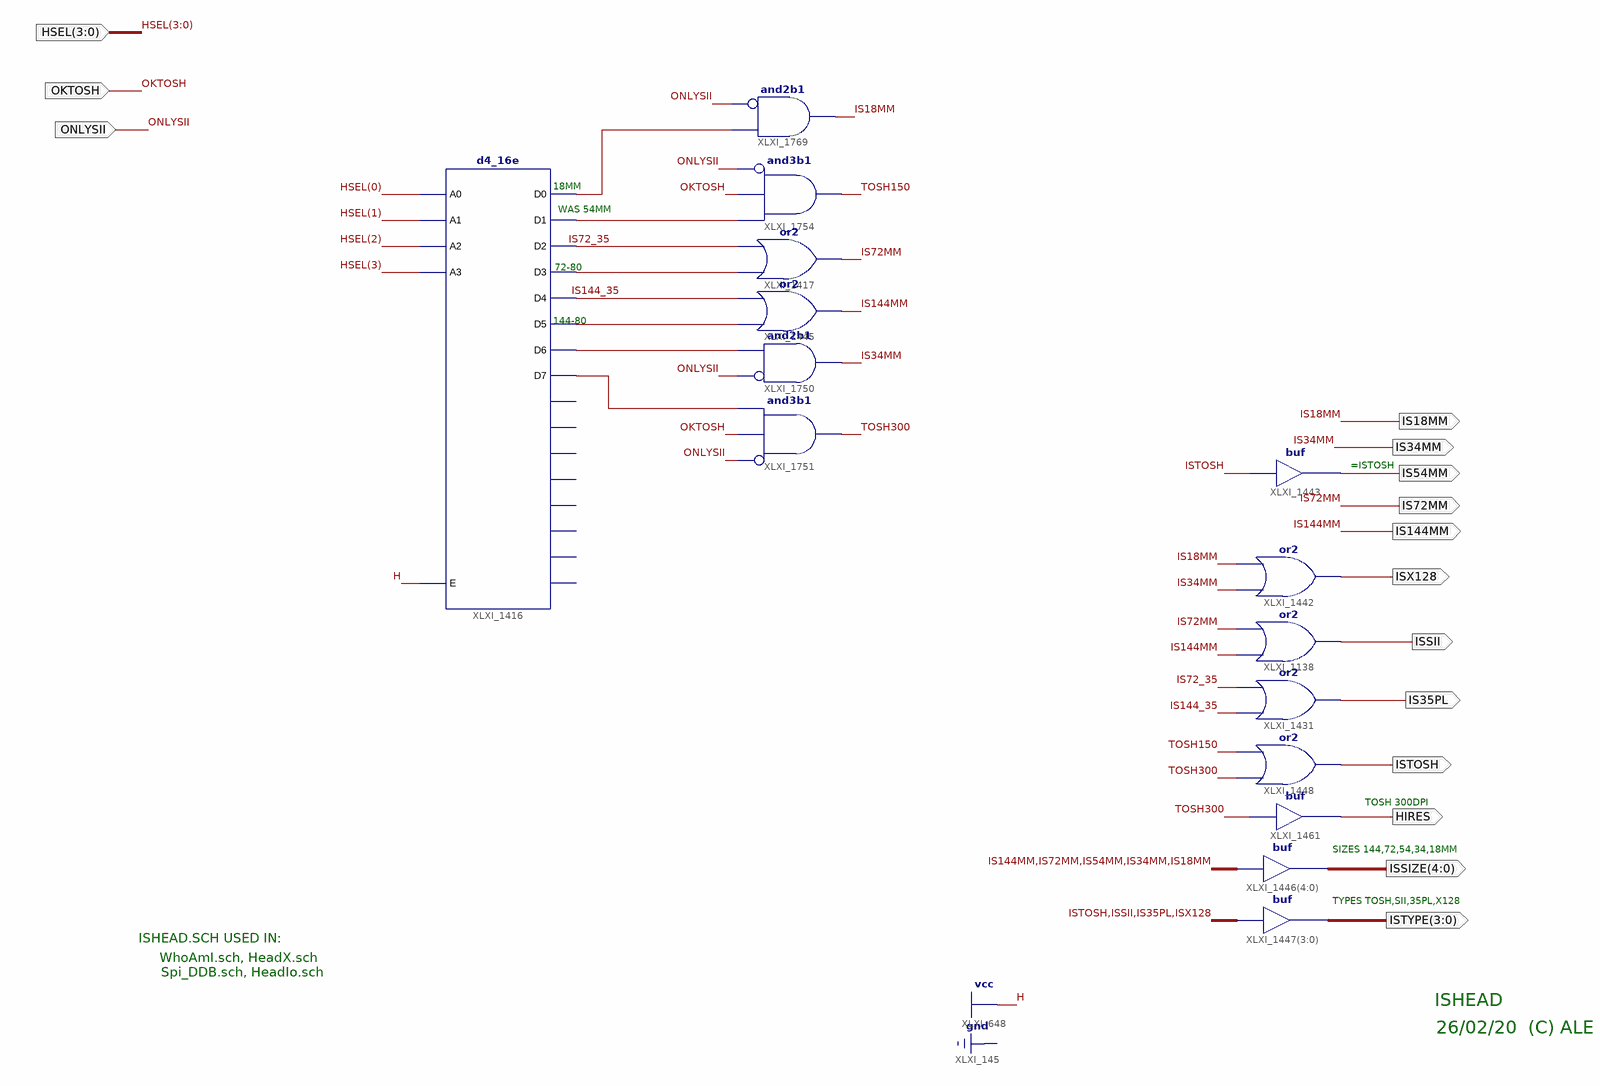
[diagram p0: schematic sheet 1]
// Xilinx ISE schematic DB_IsHead.sch (spartan3e) as structural Verilog: 15 symbols, 15 ports
module DB_IsHead (
  input  [3:0] HSEL,
  input  OKTOSH,
  input  ONLYSII,
  output IS72MM,
  output IS144MM,
  output IS18MM,
  output IS34MM,
  output IS54MM,
  output ISX128,
  output ISSII,
  output IS35PL,
  output [4:0] ISSIZE,
  output [3:0] ISTYPE,
  output ISTOSH,
  output HIRES
);

  wire IS72_35, IS144_35, TOSH150, TOSH300, XLXN_9, XLXN_121, XLXN_143, XLXN_147, XLXN_178, XLXN_235;

  or XLXI_1442 (ISX128, IS34MM, IS18MM);
  or XLXI_1138 (ISSII, IS144MM, IS72MM);
  or XLXI_1431 (IS35PL, IS144_35, IS72_35);
  assign ISSIZE = {IS144MM, IS72MM, IS54MM, IS34MM, IS18MM};  // buf XLXI_1446[4..0], 5 bits wide
  assign ISTYPE = {ISTOSH, ISSII, IS35PL, ISX128};  // buf XLXI_1447[3..0], 4 bits wide
  buf XLXI_1443 (IS54MM, ISTOSH);
  buf XLXI_1461 (HIRES, TOSH300);
  or XLXI_1448 (ISTOSH, TOSH300, TOSH150);
  d4_16e XLXI_1416 (
    .A0(HSEL[0]), .A1(HSEL[1]), .A2(HSEL[2]), .A3(HSEL[3]), .E(1'b1), .D0(XLXN_235), .D1(XLXN_147),
    .D2(IS72_35), .D3(XLXN_9), .D4(IS144_35), .D5(XLXN_121), .D6(XLXN_178), .D7(XLXN_143));  // open: D10, D11, D12, D13, D14, D15, D8, D9
  and XLXI_1754 (TOSH150, ~ONLYSII, OKTOSH, XLXN_147);  // and3b1
  and XLXI_1751 (TOSH300, ~ONLYSII, OKTOSH, XLXN_143);  // and3b1
  and XLXI_1750 (IS34MM, ~ONLYSII, XLXN_178);  // and2b1
  and XLXI_1769 (IS18MM, ~ONLYSII, XLXN_235);  // and2b1
  or XLXI_1417 (IS72MM, XLXN_9, IS72_35);
  or XLXI_1445 (IS144MM, XLXN_121, IS144_35);

  // Notes on the sheet:
  //   18MM
  //   WAS 54MM
  //   72-80
  //   144-80
  //   =ISTOSH
  //   TOSH 300DPI
  //   SIZES 144,72,54,34,18MM
  //   TYPES TOSH,SII,35PL,X128
  //   ISHEAD.SCH USED IN:
  //   WhoAmI.sch, HeadX.sch
  //   Spi_DDB.sch, HeadIo.sch
  //   ISHEAD
  //   26/02/20  (C) ALE
endmodule
